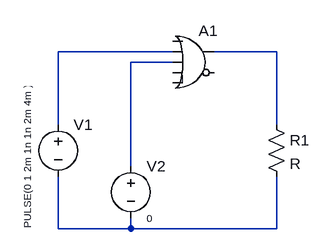
[diagram p0: schematic Draft10.asc]
Draft10.asc, the LTspice schematic file:
Version 4
SHEET 1 880 680
WIRE 224 80 48 80
WIRE 384 80 288 80
WIRE 224 96 160 96
WIRE 48 192 48 80
WIRE 384 192 384 80
WIRE 160 256 160 96
WIRE 48 352 48 272
WIRE 160 352 160 336
WIRE 160 352 48 352
WIRE 384 352 384 272
WIRE 384 352 160 352
SYMBOL Digital\\or 256 32 R0
SYMATTR InstName A1
SYMBOL voltage 48 176 R0
WINDOW 3 -47 176 VLeft 1
SYMATTR InstName V1
SYMATTR Value PULSE(0 1 2m 1n 1n 2m 4m )
SYMBOL voltage 160 240 R0
WINDOW 3 24 96 Left 1
SYMATTR InstName V2
SYMATTR Value 0
SYMBOL res 368 176 R0
SYMATTR InstName R1

The netlist it stands for:
* Draft10.asc
A1 0 N001 N003 0 0 0 N002 0 OR
V1 N001 N004 PULSE(0 1 2m 1n 1n 2m 4m )
V2 N003 N004 0
R1 N002 N004 R
.backanno
.end